# EAGLE design Adafruit pIRkeyboard (EAGLE 9.0.1)
AUTHOR: ladyada
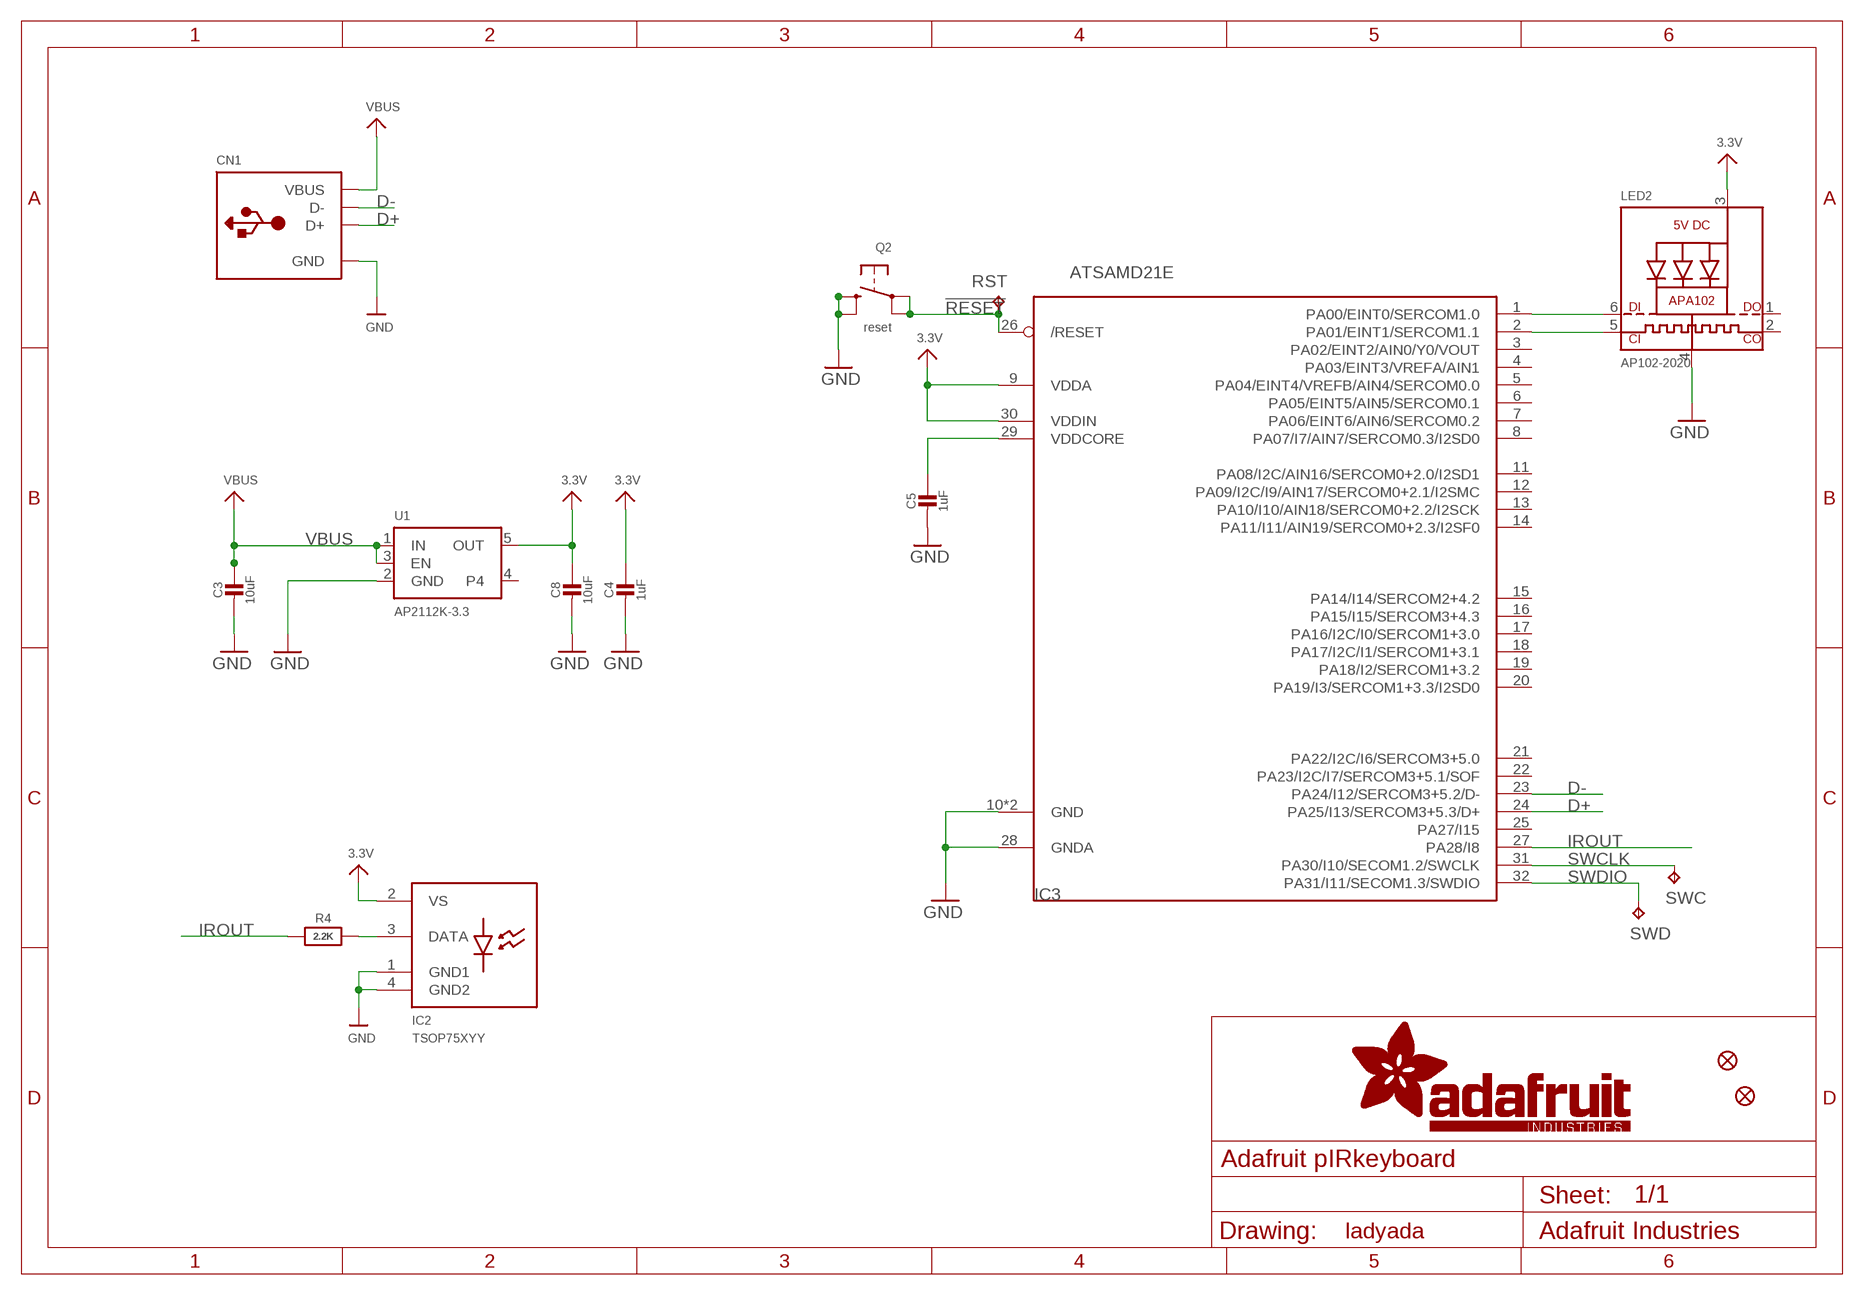
[diagram p0: schematic, sheet 1]

## Parts
C3  10uF  CAP_CERAMIC0805-NOOUTLINE  [0805-NO]
C4  1uF  CAP_CERAMIC0603_NO  [0603-NO]
C5  1uF  CAP_CERAMIC0603_NO  [0603-NO]
C8  10uF  CAP_CERAMIC0805-NOOUTLINE  [0805-NO]
CN1  USB_TYPEAPCB  [USBA_PCB]
FID1  FIDUCIAL_1MM  [FIDUCIAL_1MM]
FID2  FIDUCIAL_1MM  [FIDUCIAL_1MM]
IC2  TSOP75XYY  [TSOP75XYY]
IC3  ATSAMD21E  [QFN32_5MM]
LED2  AP102-2020  APA1022020  [APA102_2020]
Q2  reset  SWITCH_TACT_SMT4.6X2.8  [BTN_KMR2_4.6X2.8]
R4  2.2K  RESISTOR_0603_NOOUT  [0603-NO]
RST  TPTP16R  [TP16R]
SWC  TPTP15R  [TP15R]
SWD  TPTP16R  [TP16R]
U1  AP2112K-3.3  VREG_SOT23-5  [SOT23-5]

## Nets
3.3V: C4.1 C8.1 IC2.2(VS) IC3.9(VDDA) IC3.30(VDDIN) LED2.3(VDD) U1.5(OUT)
!RESET: IC3.26(/RESET) Q2.A'(P1) Q2.A(P) RST.TP
A3: IC3.1(PA00/EINT0/SERCOM1.0) LED2.6(DI)
D+: CN1.USB_PLUS(D+) IC3.24(PA25/I13/SERCOM3+5.3/D+)
D-: CN1.USB_NEG(D-) IC3.23(PA24/I12/SERCOM3+5.2/D-)
GND: C3.2 C4.2 C5.2 C8.2 CN1.GND IC2.1(GND1) IC2.4(GND2) IC3.10(GND) IC3.28(GNDA) IC3.33(GND) LED2.4(GND) Q2.B'(S1) Q2.B(S) U1.2(GND)
IROUT: IC3.27(PA28/I8) R4.1
N$5: IC2.3(DATA) R4.2
N$9: IC3.2(PA01/EINT1/SERCOM1.1) LED2.5(CKI)
SWCLK: IC3.31(PA30/I10/SECOM1.2/SWCLK) SWC.TP
SWDIO: IC3.32(PA31/I11/SECOM1.3/SWDIO) SWD.TP
VBUS: C3.1 CN1.VCC(VBUS) U1.1(IN) U1.3(EN)
VDDCORE1: C5.1 IC3.29(VDDCORE)
Unconnected: IC3.3(PA02/EINT2/AIN0/Y0/VOUT) IC3.4(PA03/EINT3/VREFA/AIN1) IC3.5(PA04/EINT4/VREFB/AIN4/SERCOM0.0) IC3.6(PA05/EINT5/AIN5/SERCOM0.1) IC3.7(PA06/EINT6/AIN6/SERCOM0.2) IC3.8(PA07/I7/AIN7/SERCOM0.3/I2SD0) IC3.11(PA08/I2C/AIN16/SERCOM0+2.0/I2SD1) IC3.12(PA09/I2C/I9/AIN17/SERCOM0+2.1/I2SMC) IC3.13(PA10/I10/AIN18/SERCOM0+2.2/I2SCK) IC3.14(PA11/I11/AIN19/SERCOM0+2.3/I2SF0) IC3.15(PA14/I14/SERCOM2+4.2) IC3.16(PA15/I15/SERCOM3+4.3) IC3.17(PA16/I2C/I0/SERCOM1+3.0) IC3.18(PA17/I2C/I1/SERCOM1+3.1) IC3.19(PA18/I2/SERCOM1+3.2) IC3.20(PA19/I3/SERCOM1+3.3/I2SD0) IC3.21(PA22/I2C/I6/SERCOM3+5.0) IC3.22(PA23/I2C/I7/SERCOM3+5.1/SOF) IC3.25(PA27/I15) LED2.1(DO) LED2.2(CKO) U1.4

## Library data of the parts
C3-C5 C8 = microbuilder:CAP_CERAMIC: Ceramic Capacitors For new designs, use the packages preceded by an '_' character since they are more reliable: The following footprints should be used on most boards: _0402 - Standard footprint for regular board layouts _0603 - Standard footprint for regular board layouts _0805 - Standard footprint for regular board layouts _1206 - Standard footprint for regular board layouts For extremely tight-pitch boards where space is at a premium, the following 'micro-pitch' footprints can be used (smaller pads, no silkscreen outline, etc.): _0402MP - Micro-pitch footprint for very dense/compact boards _0603MP - Micro-pitch footprint for very dense/compact boards _0805MP - Micro-pitch footprint for very dense/compact boards _1206MP - Micro-pitch footprint for very dense/compact boards
CN1 = microbuilder:USB_TYPEA: USB - Type A Connectors Male types stick out and are inserted into a PC or matching females parts (these are the connectors used on USB Memory Sticks, etc.). Female parts are generally used for USB Host and accept a male-type connector. SMT - 4UCON: 10017 PTHFML - Digikey: 609-1045-ND, 4UCon: 05241 PCB - Use 2.0mm thick PCBs with this footprint
FID1 FID2 = microbuilder:FIDUCIAL: Fiducial Alignment Points Various fiducial points for machine vision alignment.; BOM: EXCLUDE
IC2 = TSOP75XYY:TSOP75XYY: Vishay TSOP75XYY, where X is 2 (normal), or 4 (high noise environments, and YY is the demodulation frequency (36, 38, 40 KHz).
IC3 = microbuilder:ATSAMD21E
LED2 = microbuilder:APA102: APA102/DotStar Pixels VCC: 5V DC Refresh Rate: 400Hz
Q2 = microbuilder:SWITCH_TACT_SMT: SMT Tact Switches 6x6mm - Digikey: P12940SCT-ND KMR2 (4.6x2.8mm) - Digikey: 401-1426-1-ND EVQ-PQHB55 - Light Touch, 160GF (4.5x4.5mm) - Digikey: P8090SCT-ND KMT0 - KMT021 NGJ LHS (etc.) IP68/Waterproof - Digikey: CKN10289CT-ND
R4 = microbuilder:RESISTOR: Resistors For new designs, use the packages preceded by an '_' character since they are more reliable: The following footprints should be used on most boards: _0402 - Standard footprint for regular board layouts _0603 - Standard footprint for regular board layouts _0805 - Standard footprint for regular board layouts _1206 - Standard footprint for regular board layouts For extremely tight-pitch boards where space is at a premium, the following 'micro-pitch' footprints can be used (smaller pads, no silkscreen outline, etc.): _0402MP - Micro-pitch footprint for very dense/compact boards _0603MP - Micro-pitch footprint for very dense/compact boards _0805MP - Micro-pitch footprint for very dense/compact boards _1206MP - Micro-pitch footprint for very dense/compact boards
RST SWC SWD = testpad:TP: Test pad
U1 = microbuilder:VREG_SOT23-5: SOT23-5 Fixed Voltage Regulators Part Current Out V Out V In V Dropout θJA (°C/W) TJ (°C) Digikey Part No. ADP121 150mA 3.3V 3.4-5.5V 0.09V @ 150mA -- -- ADP121-AUJZ33R7CT-ND ADP121 150mA 3.0V 3.1-5.5V 0.09V @ 150mA -- -- ADP121-AUJZ30R7CT-ND ADP122 300mA 3.3V 3.4-5.5V 0.085V @ 300mA -- -- ADP122AUJZ-3.3-R7CT-ND ADP1712 300mA 3.3V 3.5-5.5V 0.17V @ 300mA -- -- ADP1712AUJZ-3.3-R7TR-ND AP7311 (Low Cost) 150mA 3.3V 3.5-6V 0.15V @ 150mA -- -- AP7311-33WG-7DICT-ND LD39015M18R 150mA 1.8V 1.9V-5.5V 0.08V @ 100mA -- -- 497-6977-1-ND LP2985A-33DBVR 150mA 3.3V 3.3-16V 0.28V @ 150mA 206 150 296-18479-1-ND MCP1824T-3302E/OT 300mA 3.3V 3.5V-6V 0.2V @ 300mA -- -- MCP1824T-3302E/OTCT-ND MIC5205-2.5YM5 TR 150mA 2.5V 2.7-16V 0.165V @ 150mA -- -- 576-1257-2-ND MIC5205-3.0YM5 TR 150mA 3.0V 3.2V-16V 0.165V @ 150mA -- -- 576-1258-2-ND MIC5205-3.3YM5 TR 150mA 3.3V 3.5V-16V 0.165V @ 150mA -- -- 576-1259-2-ND TPS780330220 150mA 3.3V+2.2V 3.6-5.5V 250mV Max -- -- 296-23332-1-ND TDA3663/N1,135 100mA 3.3V 3.5-45V 0.18V @ 50mA -- -- 568-5343-1-ND Max operating temp can be calculated using θJA, TJ (max junction temperature), and power in watts. Set the "Maximum Ambient Temperature" until it reaches TJ ("Max Junction Temperature"), which is the absolute limit for safe use of the regulator: Heat Sink Temperature Calculator <http://www.daycounter.com/Calculators/Heat-Sink-Temperature-Calculator.phtml> For example, With 12V source into a 3.3V LP2985 and a 30mA load, we are dissipating (12V-3.3V) * 0.03A = 0.261W. With a θJA of 206 °C/W, a TJ of 150°C, and 261mW we can safely use the chip without a heat sink up to 75°C (=147.1°C Junction Temperature).

## Board
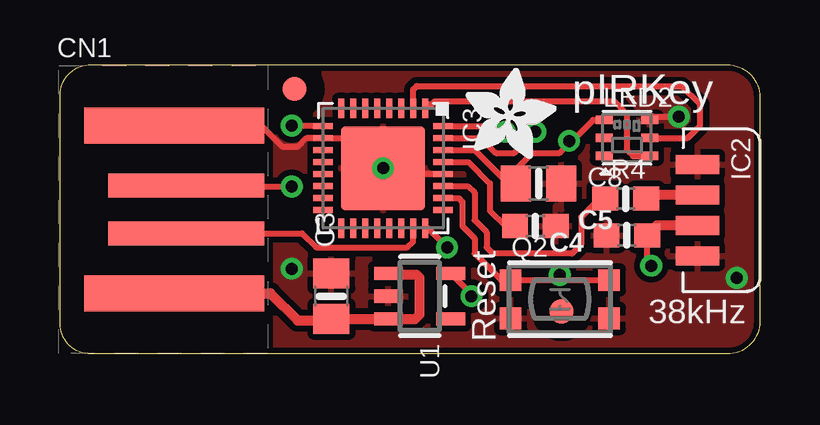
[diagram p1: board, top side]
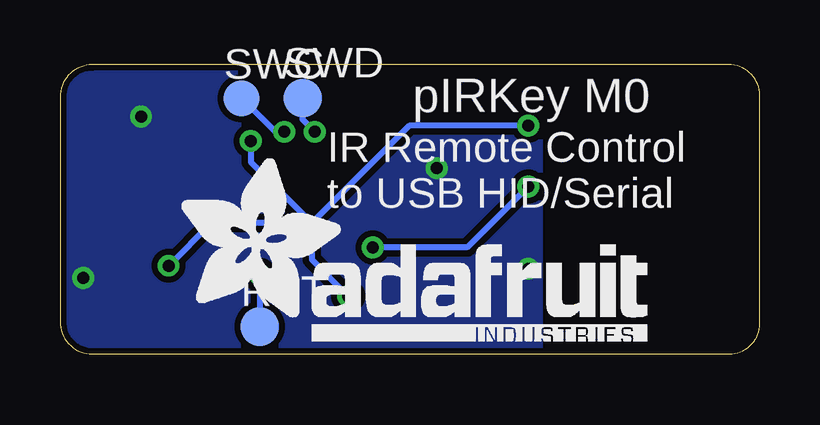
[diagram p2: board, bottom side, seen from below]

Size 29.16 x 12.06 mm. Coordinates in mm from the lower left corner, seen from the top.
Outline: 0,10.79 arc-90 1.3,12.06 27.81,12.06 arc-90 29.16,10.71 29.16,1.35 arc-90 27.81,0 1.27,0 arc-90 0,1.27 0,10.79
Copper layers (1*16): Top 0.035mm / dielectric 1.5mm / Bottom 0.035mm
Design rules "adafruit *": minimum track width 8mil, minimum drill 16mil, track to track 8mil, track to pad 8mil, pad to pad 8mil, via to via 8mil, smd to smd 8mil, copper to edge 10mil, drill to drill 8mil, minimum pad ring 10mil, minimum via ring 8mil, stop-mask expansion 4mil, vias tented up to drill 20mil, thermal gap 10mil

### Footprints (pad centres in the part's own frame; a part is rotated, then mirrored left to right if it is on the bottom)
0805-NO = smd 1.24 x 1.5: 1 -0.95,0; 2 0.95,0
0603-NO = smd 1.075 x 1: 1 -0.85,0; 2 0.85,0
USBA_PCB = smd 7.5 x 1.5: GND -0.2,3.5; VCC -0.2,-3.5 | smd 6.5 x 1: USB_NEG 0.3,-1; USB_PLUS 0.3,1
FIDUCIAL_1MM = smd 1 x 1: 1 0,0
TSOP75XYY = smd 0.8 x 1.8: 1 -1.905,0; 2 -0.635,0; 3 0.635,0; 4 1.905,0
QFN32_5MM = smd 0.8 x 0.25: 1 -2.5,1.75; 2 -2.5,1.25; 3 -2.5,0.75; 4 -2.5,0.25; 5 -2.5,-0.25; 6 -2.5,-0.75; 7 -2.5,-1.25; 8 -2.5,-1.75; 17 2.5,-1.75; 18 2.5,-1.25; 19 2.5,-0.75; 20 2.5,-0.25; 21 2.5,0.25; 22 2.5,0.75; 23 2.5,1.25; 24 2.5,1.75 | smd 0.25 x 0.8: 9 -1.75,-2.5; 10 -1.25,-2.5; 11 -0.75,-2.5; 12 -0.25,-2.5; 13 0.25,-2.5; 14 0.75,-2.5; 15 1.25,-2.5; 16 1.75,-2.5; 25 1.75,2.5; 26 1.25,2.5; 27 0.75,2.5; 28 0.25,2.5; 29 -0.25,2.5; 30 -0.75,2.5; 31 -1.25,2.5; 32 -1.75,2.5 | smd 3.5 x 3.5: 33 0,0
APA102_2020 = smd 0.7 x 0.35: 1 -0.95,-0.75; 2 -0.95,0; 3 -0.95,0.75; 4 0.95,0.75; 5 0.95,0; 6 0.95,-0.75
BTN_KMR2_4.6X2.8 = smd 0.9 x 0.9: A 2.05,0.8; A' -2.05,0.8; B 2.05,-0.8; B' -2.05,-0.8
TP16R = smd 1.6 x 1.6: TP 0,0
TP15R = smd 1.5 x 1.5: TP 0,0
SOT23-5 = smd 0.55 x 1.2: 1 -0.95,-1.3; 2 0,-1.3; 3 0.95,-1.3; 4 0.95,1.3; 5 -0.95,1.3

### Placement (x,y rotation side)
C3  11.3,2.41 90 top
C4  23.62,4.95 180 top
C5  19.81,5.33 0 top
C8  19.94,7.11 0 top
CN1  4.95,6.03 0 top
FID1  9.78,11.05 0 top
FID2  20.9,1.78 0 top
IC2  26.56,6 90 top
IC3  13.46,7.75 270 top
LED2  23.62,9.02 0 top
Q2  20.83,2.29 0 top
R4  23.57,6.48 0 top
RST  20.83,1.14 0 bottom
SWC  21.59,10.67 0 bottom
SWD  19.05,10.67 0 bottom
U1  14.99,2.41 270 top
U$8  [ADAFRUIT_TEXT_20MM]  24.25,0.54 0 bottom
U$12  [ADAFRUIT_3.5MM]  16.89,8.13 0 top

### Tracks (layer width: path | path; a pad name or v marks a point on that pad's centre or on a via)
3.3V  (via drill 0.5)
  Top 0.254: U1.5 17.24,2.41 v17.14,2.41 | v24.64,3.68 24.47,3.85 C4.1 | IC3.30 17.28,8.5 18.67,7.11 C8.1 18.99,7.69 19.68,8.38 20.83,8.38 21.34,8.89 | 21.34,8.89 22.21,9.77 LED2.3 | 21.34,8.89 v21.21,8.89 | IC3.9 9.68,9.5 v9.65,9.53
  Top 0.406: IC2.2 24.88,5.37 C4.1
  Bottom 0.254: v9.65,9.53 14.61,9.53 18.67,5.46 | v21.21,8.89 21.21,8 18.67,5.46 | 18.67,5.46 22.86,5.46 v24.64,3.68 | 18.67,5.46 18.67,3.94 v17.14,2.41
!RESET  (via drill 0.5)
  Top 0.254: 20.83,3.09 Q2.A' 18.38,3.09 17.27,4.19 17.27,4.83 16.76,5.33 16.76,6.35 16.62,6.5 IC3.26 | 20.83,3.09 Q2.A | v20.83,3.3 20.83,3.09
  Bottom 0.254: v20.83,3.3 RST.TP
A3
  Top 0.254: IC3.1 15.38,10.41 15.49,10.41 15.62,10.54 23.11,10.54 23.62,10.03 23.62,8.51 23.88,8.26 24.56,8.26 LED2.6
D+  (via drill 0.5)
  Top 0.254: CN1.USB_PLUS 5.3,6.99 v9.65,6.99 | v16.13,4.45 15.33,5.25 IC3.24
  Bottom 0.254: v9.65,6.99 12.19,4.45 v16.13,4.45
D-
  Top 0.254: CN1.USB_NEG 10.08,5.03 10.67,4.45 14.48,4.45 14.71,4.68 IC3.23
GND  (via drill 0.5)
  Top 0.254: IC3.28 13.71,7.5 IC3.33 12.21,9 IC3.10 10.27,9 9.91,8.64 9.27,8.64 8.38,9.53 CN1.GND | LED2.4 24.71,9.91 v25.78,9.91
  other vias: 28.19,3.17 9.65,3.56 13.46,7.75
  pour Top (isolate 0.254): 9.02,-0.06 9.02,12.13 29.16,12.13 29.16,-0.06
  pour Bottom (isolate 0.254): 9.14,12.06 29.16,12.19 29.16,0.13 9.14,0
IROUT
  Top 0.254: R4.1 22.48,6.48 21.72,5.71 21.72,4.57 21.34,4.19 18.03,4.19 17.78,4.45 17.78,5.08 17.27,5.59 17.27,6.73 17.02,6.99 15.97,6.99 IC3.27
N$5
  Top 0.406: IC2.3 24.58,6.63 R4.2
N$9
  Top 0.254: IC3.2 14.71,11.03 14.86,11.18 25.91,11.18 26.67,10.41 26.67,9.53 26.16,9.02 LED2.5
SWCLK  (via drill 0.5)
  Top 0.254: IC3.31 17.55,9 18.16,8.38 18.92,8.38 v19.81,9.27
  Bottom 0.254: SWC.TP 20.19,9.27 v19.81,9.27
SWDIO  (via drill 0.5)
  Top 0.254: IC3.32 18.32,9.5 v18.54,9.27
  Bottom 0.254: v18.54,9.27 19.05,9.78 SWD.TP
VBUS
  Top 0.406: CN1.VCC 8.77,2.53 9.91,1.4 11.24,1.4 C3.1 U1.3 14.8,1.46 14.99,1.65 14.99,3.17 14.86,3.3 13.75,3.3 U1.1
VDDCORE1
  Top 0.254: IC3.29 17.02,8 17.91,7.11 17.91,5.97 18.54,5.33 C5.1

### Text on the board
tPlace: pIRKey | Reset | 38kHz
bPlace: pIRKey M0 | IR Remote Control / to USB HID/Serial
tValues: C1898